# Altium schematic sheet WL-CONNECT.SchDoc
size 420 x 297 mm; Scale: 1:1; DocumentType: Схема электрическая принципиальная; FirstReferrence: АБВГ.123456.001; DocumentNumber: 12; SheetNumber: 9; SheetTotal: 12
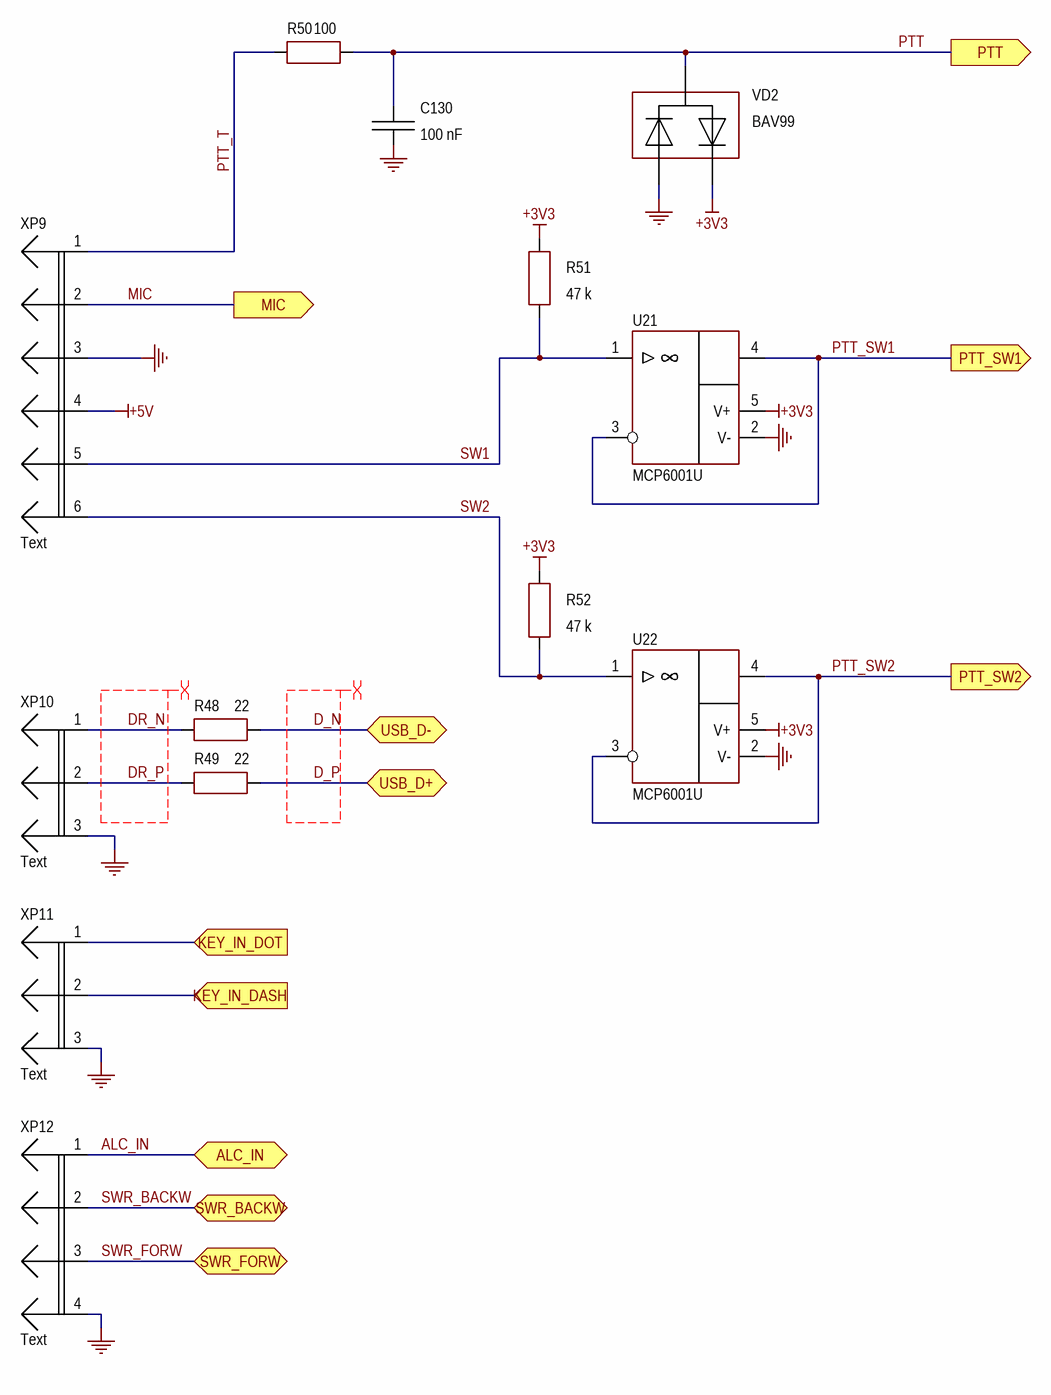
[diagram p0: WL-CONNECT.SchDoc]

## Parts
C130  100 nF  [C-0805-0.95]
R48  22  [R-0805]
R49  22  [R-0805]
R50  100  [R-0805]
R51  47 k  [R-0805]
R52  47 k  [R-0805]
U21  MCP6001U  [SOT-23-5]
U22  MCP6001U  [SOT-23-5]
VD2  BAV99  [SOT-23]
XP9  Text  [61900611121]
XP10  Text  [61900311121]
XP11  Text  [61900311121]
XP12  Text  [61900411121]

## Ports
ALC_IN (bidir), KEY_IN_DASH (in), KEY_IN_DOT (in), MIC (out), PTT (out), PTT_SW1 (out), PTT_SW2 (out), SWR_BACKW (bidir), SWR_FORW (bidir), USB_D+ (bidir), USB_D- (bidir)

## Nets
+3V3: R51.2 R52.2 U21.5(V+) U22.5(V+) VD2.2
+5V: XP9.4
GND: C130.1 U21.2(V-) U22.2(V-) VD2.1 XP9.3 XP10.3 XP11.3 XP12.4
ALC_IN: XP12.1 ; port ALC_IN
D_N: R48.2 ; port USB_D-
D_P: R49.2 ; port USB_D+
DR_N: R48.1 XP10.1
DR_P: R49.1 XP10.2
KEY_IN_DASH: XP11.2 ; port KEY_IN_DASH
KEY_IN_DOT: XP11.1 ; port KEY_IN_DOT
MIC: XP9.2 ; port MIC
PTT: C130.2 R50.2 VD2.3 ; port PTT
PTT_SW1: U21.3(-IN) U21.4(OUT) ; port PTT_SW1
PTT_SW2: U22.3(-IN) U22.4(OUT) ; port PTT_SW2
PTT_T: R50.1 XP9.1
SW1: R51.1 U21.1(+IN) XP9.5
SW2: R52.1 U22.1(+IN) XP9.6
SWR_BACKW: XP12.2 ; port SWR_BACKW
SWR_FORW: XP12.3 ; port SWR_FORW

## Layout directives
differential pair: D_N, D_P, DR_N, DR_P

## Notes on the sheet
- Подп. дата
- Инв. № дубл.
- Взам. инв. №
- Подп. и дата
- Инв. № подл.
- Изм.
- Лист
- № докум.
- Подп.
- Дата
- ALTIUM GOSTBOM2.0 KEV
- Файл:
- Копировал
- Формат А3

## Library data of the parts
C130 = CC0805KRX7R9BB104: Manufacturer: Yageo; Value: 100; Type: Конденсатор; Dielectric: X7R; Tolerance: ±10%; Voltage: 50 V; CommentDOC: ( CC - 0805 - X7R - 50 V - 100 nF ±10% ); Part Number: CC0805KRX7R9BB104; Units: nF; Case: 0805; Operating Temperature: -55 ... 125 °C; Series: CC; Value+Units: 100 nF; ValueSCH: 100 nF; ( Series - Case - Dielectric -  Voltage - Value+Units Tolerance: ( CC - 0805 - X7R - 50 V - 100 nF ±10% )
R48 R49 = RC0805JR-0722RL: Manufacturer: Yageo; Power: 0,125 W; Units: Ohm; Tolerance: ±5%; Operating Voltage: 150 V; Value+Units: 22 Ohm; CommentDOC: ( RC - 0805 - 0,125 W - 22 Ohm  ±5% ); Value: 22; Type: Резистор; Part Number: RC0805JR-0722RL; Case: 0805; Operating Temperature: -55°C ... 155°C; ValueSCH: 22; Series: RC
R50 = RC0805JR-07100RL: Manufacturer: Yageo; Power: 0,125 W; Units: Ohm; Tolerance: ±5%; Operating Voltage: 150 V; Value+Units: 100 Ohm; CommentDOC: ( RC - 0805 - 0,125 W - 100 Ohm  ±5% ); Value: 100; Type: Резистор; Part Number: RC0805JR-07100RL; Case: 0805; Operating Temperature: -55°C ... 155°C; ValueSCH: 100; Series: RC
R51 R52 = RC0805JR-0747KL: Manufacturer: Yageo; Value: 47; Power: 0,125 W; Units: kOhm; Tolerance: ±5%; Operating Voltage: 150 V; Value+Units: 47 kOhm; CommentDOC: ( RC - 0805 - 0,125 W - 47 kOhm  ±5% ); Type: Резистор; Part Number: RC0805JR-0747KL; Case: 0805; Operating Temperature: -55°C ... 155°C; ValueSCH: 47 k; Series: RC
U21 U22 = MCP6001UT-I/OT: IC OPAMP GP 1 CIRCUIT SOT-23-5; Manufacturer: Microchip Technology; Bandwidth: 1 MHz; Voltage  Supply: +1,8 V...±6 V; Type: Микросхема; Part Number: MCP6001UT-I/OT; Case: SOT-23-5; Operating Temperature: −40°C … 85°C
VD2 = BAV99,215: Manufacturer: Nexperia USA Inc.; Type: Диод; Voltage Revers: 100 V; Current: 215 mA; Part Number: BAV99,215; ValueSCH: BAV99; Case: SOT-23; Operating Temperature: -65°С ... 150°С
XP9 = 61900611121: Manufacturer: Würth Elektronik; Pitch: 2,54 mm; Functional Analog: WF-6; Type: Вилка; Part Number: 61900611121; Series: WE-WTB; Number of Pins: 6; Operating Temperature: −40°C ... 105°C
XP10 XP11 = 61900311121: Manufacturer: Würth Elektronik; Pitch: 2,54 mm; Functional Analog: WF-3; Type: Вилка; Part Number: 61900311121; Series: WE-WTB; Number of Pins: 3; Operating Temperature: −40°C ... 105°C
XP12 = 61900411121: Manufacturer: Würth Elektronik; Pitch: 2,54 mm; Functional Analog: WF-4; Type: Вилка; Part Number: 61900411121; Series: WE-WTB; Number of Pins: 4; Operating Temperature: −40°C ... 105°C